# EAGLE schematic billdetect_irxmit1 (EAGLE 5.11)
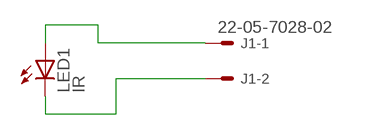
[diagram p0: schematic, sheet 1]

## Parts
J1  22-05-7028-02  [7395-02]
LED1  IR  LED5MM  [LED5MM]

## Nets
N$1: J1.2 LED1.K(C)
N$2: J1.1 LED1.A

## Library data of the parts
J1 = con-molex:22-?-02: CONNECTOR wire to board 2.54 mm (.1 inch) pitch header; OC_FARNELL: 9731601; OC_NEWARK: unknown
LED1 = SparkFun-20090330:LED: LEDs Standard schematic elements and footprints for 5mm, 3mm, 1206, and 0603 sized LEDs. 5mm - Spark Fun Electronics SKU : COM-00529 (and others)